# Altium project E1-Project-PCB Board.PrjPcb
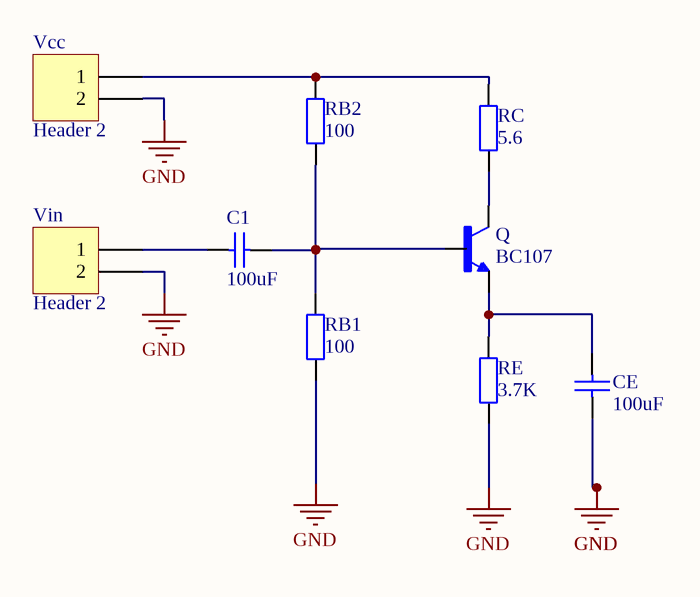
[diagram p0: Sheet1.SchDoc]
1 sheet, 9 parts. Net scope: global (net labels, ports and power ports of the same name join across sheets).
Board file: PCB1.PcbDoc

## Sheet Sheet1.SchDoc
size C

### Parts
C1  value 100uF  [Cap]  (hidden comment: Cap)
CE  value 100uF  [Cap]  (hidden comment: Cap)
Q  BC107  [TO18]
RB1  value 100  [Res 100-DIP]  (hidden comment: Res1)
RB2  value 100  [Res 100-DIP]  (hidden comment: Res1)
RC  value 5.6  [Res 100-DIP]  (hidden comment: Res1)
RE  RE: 3.7K  [Res 2.7-DIP]  (hidden comment: Res1)
Vcc  Header 2  [HDR1X2]
Vin  Header 2  [HDR1X2]

### Nets
GND: CE.1 RB1.1 RE.1 Vcc.2 Vin.2
NetC1_1: C1.1 Q.2(B) RB1.2 RB2.1
NetC1_2: C1.2 Vin.1
NetCE_2: CE.2 Q.1(E) RE.2
NetQ_3: Q.3(C) RC.1
NetRB2_2: RB2.2 RC.2 Vcc.1

### Library data of the parts
Q = BC107: Bipolar _BJT_ Transistor NPN 45V 200mA 150MHz 600mW Through Hole TO-18; MF: STMicroelectronics; Price: None; SnapEDA_Link: https://www.snapeda.com/parts/BC107/STMicroelectronics/view-part/4705028/?ref=snap; Availability: Unavailable; MP: BC107; Value: *; Package: TO-18 STMicroelectronics
RB1 RB2 RC = Res 100-DIP_8: LatestRevisionDate: 17-Jul-2002; LatestRevisionNote: Re-released for DXP Platform.; Publisher: Altium Limited; PackageReference: AXIAL-0.4; Published: 8-Jun-2000
RE = Res 2.7-DIP: LatestRevisionDate: 17-Jul-2002; LatestRevisionNote: Re-released for DXP Platform.; Publisher: Altium Limited; PackageReference: AXIAL-0.4; Published: 8-Jun-2000
Vcc Vin = Header 2: Header, 2-Pin; LatestRevisionDate: 17-Jul-2002; LatestRevisionNote: Re-released for DXP Platform.; Publisher: Altium Limited
C1 CE = Cap: Published: 8-Jun-2000; LatestRevisionDate: 17-Jul-2002; LatestRevisionNote: Re-released for DXP Platform.; PackageReference: RAD-0.3; Publisher: Altium Limited